# Altium schematic sheet 08.SchDoc
size 386 x 246 mm
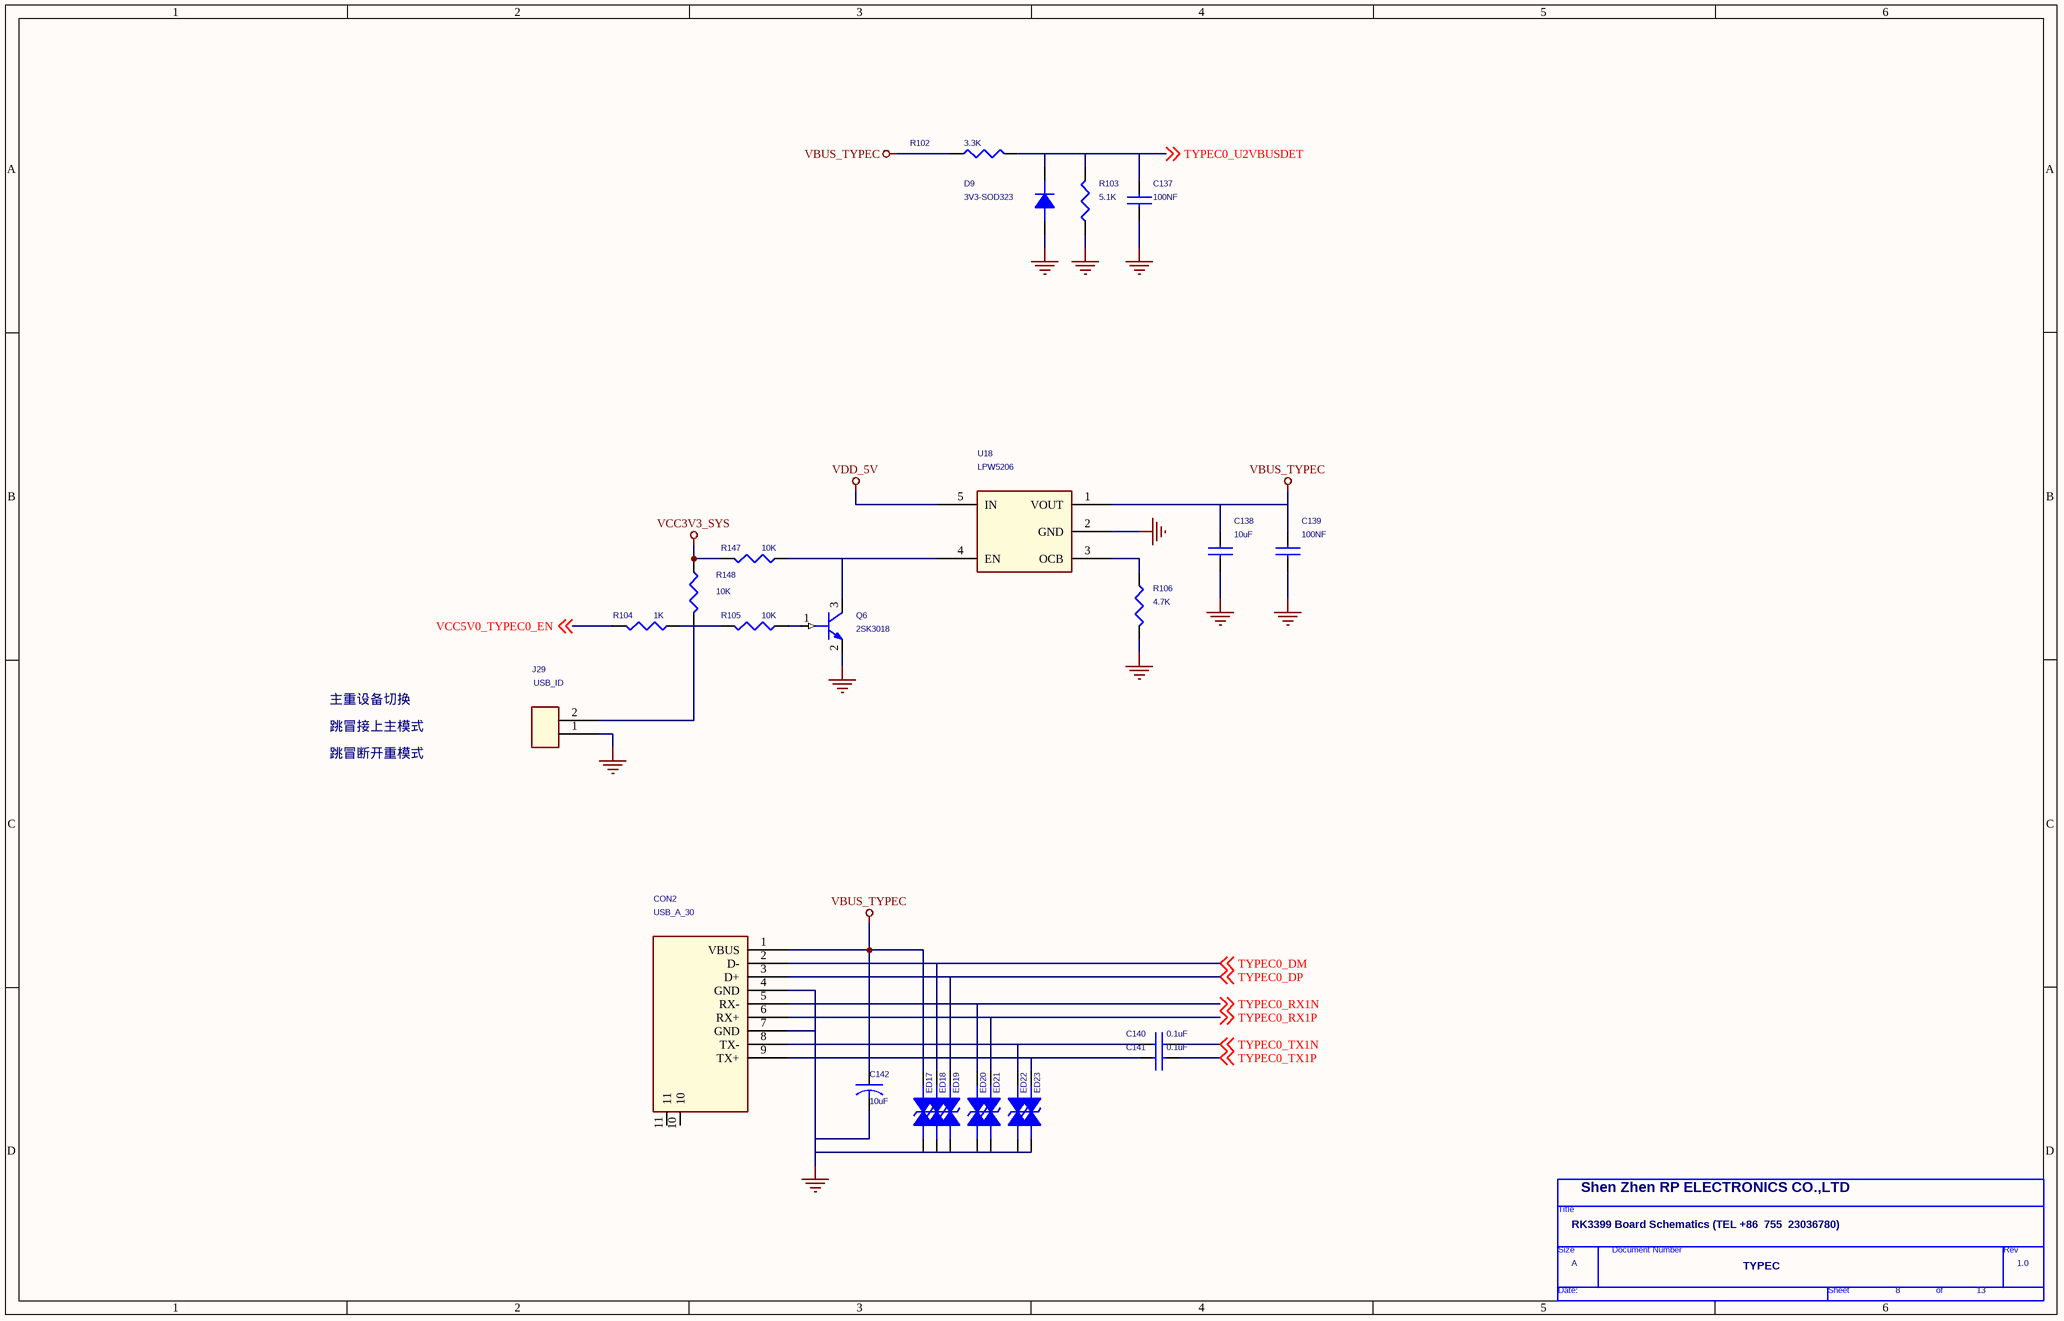
[diagram p0: 08.SchDoc]

## Parts
*  Doc: TYPEC  RevCode: 1.0  Title: RK3399 Board Schematics (TEL +86  755  23036780)  Page Size: A  Page Number: 8  Page Count: 13  Cage Code: Shen Zhen RP ELECTRONICS CO.,LTD  (hidden comment: TitleBlock0)  (graphical)
C137  100NF  [0402_cc]
C138  10uF  [0603_cc]
C139  100NF  [0402_cc]
C140  0.1uF  [C-0603]
C141  0.1uF  [C-0603]
C142  10uF  [0603_cc]
CON2  USB_A_30  [USB30]
D9  3V3-SOD323  [SOD-323]
ED17  ESD  [0402_cc]  (value not drawn)
ED18  ESD  [0402_cc]  (value not drawn)
ED19  ESD  [0402_cc]  (value not drawn)
ED20  ESD  [0402_cc]  (value not drawn)
ED21  ESD  [0402_cc]  (value not drawn)
ED22  ESD  [0402_cc]  (value not drawn)
ED23  ESD  [0402_cc]  (value not drawn)
J29  USB_ID  [idc2pin]
Q6  2SK3018  [SOT-23]
R102  3.3K  [R0402]
R103  5.1K  [R0402]
R104  1K  [0402_CC]
R105  10K  [0402_CC]
R106  4.7K  [R0402]
R147  10K  [0402_CC]
R148  10K  [0402_CC]
U18  LPW5206  [SOT_23_5]

## Nets
GND: C137.2 C138.2 C139.2 C142.2 CON2.4(GND) CON2.7(GND) D9.1(A) ED17.2 ED18.2 ED19.2 ED20.2 ED21.2 ED22.2 ED23.2 J29.1 Q6.2(EMITTER) R103.1 R106.2 U18.2(GND)
VBUS_TYPEC: C138.1 C139.1 C142.1 CON2.1(VBUS) ED17.1 R102.1 U18.1(VOUT)
VCC3V3_SYS: R147.2 R148.1
VDD_5V: U18.5(IN)
TYPEC0_DM: CON2.2(D-) ED18.1 ; off-sheet TYPEC0_DM
TYPEC0_DP: CON2.3(D+) ED19.1 ; off-sheet TYPEC0_DP
TYPEC0_RX1N: CON2.5(RX-) ED20.1 ; off-sheet TYPEC0_RX1N
TYPEC0_RX1P: CON2.6(RX+) ED21.1 ; off-sheet TYPEC0_RX1P
TYPEC0_TX1N: C140.2 ; off-sheet TYPEC0_TX1N
TYPEC0_TX1P: C141.2 ; off-sheet TYPEC0_TX1P
TYPEC0_U2VBUSDET: C137.1 D9.2(K) R102.2 R103.2 ; off-sheet TYPEC0_U2VBUSDET
VCC5V0_TYPEC0_EN: R104.2 ; off-sheet VCC5V0_TYPEC0_EN
NetC140_1: C140.1 CON2.8(TX-) ED22.1
NetC141_1: C141.1 CON2.9(TX+) ED23.1
NetJ29_2: J29.2 R104.1 R105.2 R148.2
NetQ6_1: Q6.1(BASE) R105.1
NetQ6_3: Q6.3(COLLECT) R147.1 U18.4(EN)
NetR106_1: R106.1 U18.3(OCB)

Not connected (* = marked no-connect by the designer): CON2 10 11

## Notes on the sheet
- 主重设备切换
- 跳冒接上主模式
- 跳冒断开重模式
- (in symbol TitleBlock0) Title; Size; Document Number; Rev; Date:; Sheet; of

## Library data of the parts
C137 C139 = CAP NP_4: cap,100.00nF,+/-10%,16V,X5R,C0402; Manufacturer: TDK; RK PN: C1005X5R1C104K050BA; Priority: A; Tolerance: 10%; Voltage: 16V; Dielectric: X5R; Part Type: C0402; Manufacturer PN: C1005X5R1C104K050BA; Created by: JJJ
C138 = CAP NP_4: cap,10.00uF,+/-10%,10V,X5R,C0805; Manufacturer PN: C2012X5R1A106K125AB; Manufacturer: TDK; Tolerance: 10%; Priority: A; Voltage: 10V; Dielectric: X5R; Created by: JJJ; Part Type: C0805; RK PN: C2012X5R1A106K125AB
C140 C141 = CAP_Dup2
C142 = CAP_Dup1
CON2 = USBA_3: Priority: A; RK PN: USB30; Part Type: USB Jack; Created by: JJJ
D9 = DIODE_Dup2
ED17-ED23 = DIODE BI-DIR TRIG: DESCRIPTION: ESD
J29 = CON2
Q6 = NPN_1
R102 = RESISTOR_4: 通用厚膜电阻,3K3,+/-0.5%,R0402,1/16W.; Manufacturer PN: RC0402DR-073K3L; Manufacturer: YAGEO; Tolerance: 0.5%; Wattage: 1/16W; Priority: A; Created by: YTL; Part Type: 通用厚膜电阻; RK PN: RC0402DR-073K3L
R103 = RESISTOR_4: 通用厚膜电阻,5K1,+/-0.5%,R0402,1/16W.; Manufacturer: YAGEO; Tolerance: 0.5%; RK PN: RC0402DR-075K1L; Priority: A; Wattage: 1/16W; Part Type: 通用厚膜电阻; Manufacturer PN: RC0402DR-075K1L; Created by: YTL
R104 R105 R147 R148 = R_Dup1
R106 = RESISTOR_2: 通用厚膜电阻,10K,+/-5%,R0402,1/16W.; Manufacturer: YAGEO; Tolerance: 5%; RK PN: RC0402JR-0710KL; Priority: A; Wattage: 1/16W; Part Type: 通用厚膜电阻; Manufacturer PN: RC0402JR-0710KL; Created by: YTL
U18 = SWITCH_SY6280: Low Loss Power Distribution Switch; Manufacturer PN: SY6280AAC; Manufacturer: Silergy（矽力杰）; Option: /TT9107/CW3031; Priority: A; Created by: JJJ; Part Type: Switch; RK PN: SY6280AAC
* = TitleBlock0: Page Create Date: March  8, 1995